# Altium schematic sheet Power.SchDoc
size B; SheetNumber: 8; SheetTotal: 15
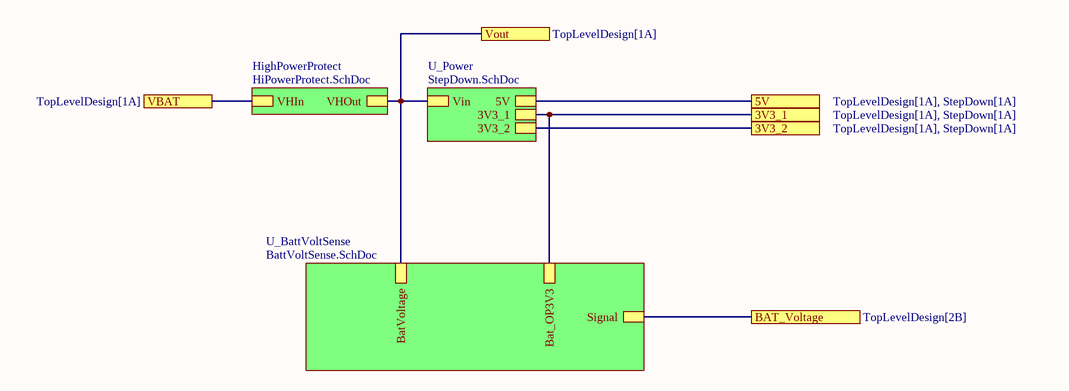
[diagram p0: Power.SchDoc]

## Sub-sheets
HighPowerProtect = HiPowerProtect.SchDoc: VHIn, VHOut
U_BattVoltSense = BattVoltSense.SchDoc: BatVoltage, Signal, Bat_OP3V3
U_Power = StepDown.SchDoc: Vin, 5V, 3V3_1, 3V3_2

## Ports
3V3_1 (see TopLevelDesign[1A], StepDown[1A]), 3V3_2 (see TopLevelDesign[1A], StepDown[1A]), 5V (see TopLevelDesign[1A], StepDown[1A]), BAT_Voltage (see TopLevelDesign[2B]), VBAT (see TopLevelDesign[1A]), Vout (see TopLevelDesign[1A])

## Nets
3V3_1: port 3V3_1, sheet U_Power/3V3_1, sheet U_BattVoltSense/Bat_OP3V3
3V3_2: port 3V3_2, sheet U_Power/3V3_2
5V: port 5V, sheet U_Power/5V
BAT_Voltage: port BAT_Voltage, sheet U_BattVoltSense/Signal
VBAT: port VBAT, sheet HighPowerProtect/VHIn
Vout: port Vout, sheet HighPowerProtect/VHOut, sheet U_Power/Vin, sheet U_BattVoltSense/BatVoltage